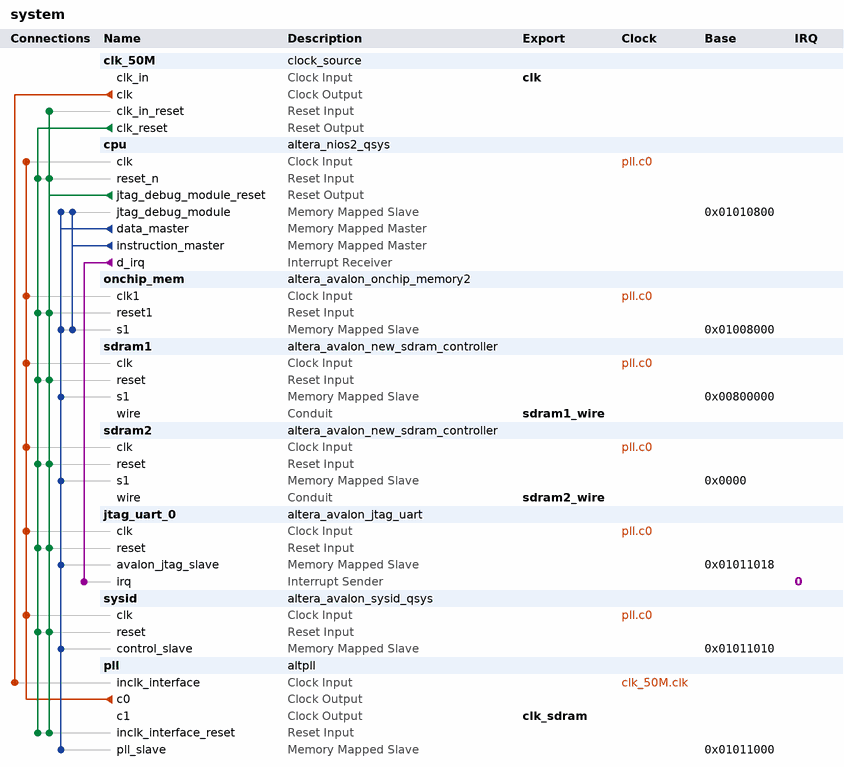
[diagram p0: system contents]
# Platform Designer (Qsys) system system, Cyclone II EP2C35F672C8
# Parameters at their usual value, and those the tool derives, are not listed.
package require -exact qsys 13.0.1.99.2
create_system system
set_project_property DEVICE_FAMILY {Cyclone II}
set_project_property DEVICE EP2C35F672C8

add_instance clk_50M clock_source 13.0
set_instance_parameter_value clk_50M clockFrequency 50000000

add_instance cpu altera_nios2_qsys 13.0
set_instance_parameter_value cpu resetSlave onchip_mem.s1
set_instance_parameter_value cpu mmu_TLBMissExcSlave None
set_instance_parameter_value cpu exceptionSlave onchip_mem.s1
set_instance_parameter_value cpu breakSlave cpu.jtag_debug_module
set_instance_parameter_value cpu impl Tiny
set_instance_parameter_value cpu icache_size 4096

add_instance onchip_mem altera_avalon_onchip_memory2 13.0.1.99.2
set_instance_parameter_value onchip_mem dataWidth 32
set_instance_parameter_value onchip_mem dualPort false
set_instance_parameter_value onchip_mem initMemContent true
set_instance_parameter_value onchip_mem initializationFileName onchip_mem.hex
set_instance_parameter_value onchip_mem memorySize 32768

add_instance sdram1 altera_avalon_new_sdram_controller 13.0.1.99.2
set_instance_parameter_value sdram1 TAC 5.5
set_instance_parameter_value sdram1 TRCD 20.0
set_instance_parameter_value sdram1 TRP 20.0
set_instance_parameter_value sdram1 casLatency 3
set_instance_parameter_value sdram1 columnWidth 8
set_instance_parameter_value sdram1 dataWidth 16
set_instance_parameter_value sdram1 generateSimulationModel false
set_instance_parameter_value sdram1 model single_Micron_MT48LC4M32B2_7_chip
set_instance_parameter_value sdram1 numberOfBanks 4
set_instance_parameter_value sdram1 numberOfChipSelects 1
set_instance_parameter_value sdram1 powerUpDelay 100.0
set_instance_parameter_value sdram1 refreshPeriod 15.625
set_instance_parameter_value sdram1 rowWidth 12

add_instance sdram2 altera_avalon_new_sdram_controller 13.0.1.99.2
set_instance_parameter_value sdram2 TAC 5.5
set_instance_parameter_value sdram2 TRCD 20.0
set_instance_parameter_value sdram2 TRP 20.0
set_instance_parameter_value sdram2 casLatency 3
set_instance_parameter_value sdram2 columnWidth 8
set_instance_parameter_value sdram2 dataWidth 16
set_instance_parameter_value sdram2 generateSimulationModel false
set_instance_parameter_value sdram2 model single_Micron_MT48LC4M32B2_7_chip
set_instance_parameter_value sdram2 numberOfBanks 4
set_instance_parameter_value sdram2 numberOfChipSelects 1
set_instance_parameter_value sdram2 powerUpDelay 100.0
set_instance_parameter_value sdram2 refreshPeriod 15.625
set_instance_parameter_value sdram2 rowWidth 12

add_instance jtag_uart_0 altera_avalon_jtag_uart 13.0.1.99.2
set_instance_parameter_value jtag_uart_0 simInteractiveOptions NO_INTERACTIVE_WINDOWS

add_instance sysid altera_avalon_sysid_qsys 13.0
set_instance_parameter_value sysid id 0

add_instance pll altpll 13.0
set_instance_parameter_value pll INCLK0_INPUT_FREQUENCY 20000
set_instance_parameter_value pll CLK0_MULTIPLY_BY 1
set_instance_parameter_value pll CLK1_MULTIPLY_BY 1
set_instance_parameter_value pll CLK0_DIVIDE_BY 1
set_instance_parameter_value pll CLK1_DIVIDE_BY 1
set_instance_parameter_value pll CLK1_PHASE_SHIFT -3000
set_instance_parameter_value pll CLK1_DUTY_CYCLE 50
set_instance_parameter_value pll PORT_clk1 PORT_USED
set_instance_parameter_value pll PORT_clk2 PORT_UNUSED
set_instance_parameter_value pll PORT_clk3 PORT_UNUSED
set_instance_parameter_value pll PORT_ARESET PORT_USED
set_instance_parameter_value pll PORT_LOCKED PORT_USED

# connections
add_connection clk_50M.clk pll.inclk_interface clock
add_connection pll.c0 cpu.clk clock
add_connection pll.c0 jtag_uart_0.clk clock
add_connection pll.c0 onchip_mem.clk1 clock
add_connection pll.c0 sdram1.clk clock
add_connection pll.c0 sdram2.clk clock
add_connection pll.c0 sysid.clk clock
add_connection clk_50M.clk_reset cpu.reset_n reset
add_connection clk_50M.clk_reset jtag_uart_0.reset reset
add_connection clk_50M.clk_reset onchip_mem.reset1 reset
add_connection clk_50M.clk_reset pll.inclk_interface_reset reset
add_connection clk_50M.clk_reset sdram1.reset reset
add_connection clk_50M.clk_reset sdram2.reset reset
add_connection clk_50M.clk_reset sysid.reset reset
add_connection cpu.jtag_debug_module_reset clk_50M.clk_in_reset reset
add_connection cpu.jtag_debug_module_reset cpu.reset_n reset
add_connection cpu.jtag_debug_module_reset jtag_uart_0.reset reset
add_connection cpu.jtag_debug_module_reset onchip_mem.reset1 reset
add_connection cpu.jtag_debug_module_reset pll.inclk_interface_reset reset
add_connection cpu.jtag_debug_module_reset sdram1.reset reset
add_connection cpu.jtag_debug_module_reset sdram2.reset reset
add_connection cpu.jtag_debug_module_reset sysid.reset reset
add_connection cpu.data_master cpu.jtag_debug_module avalon
set_connection_parameter_value cpu.data_master/cpu.jtag_debug_module baseAddress 0x01010800
add_connection cpu.data_master jtag_uart_0.avalon_jtag_slave avalon
set_connection_parameter_value cpu.data_master/jtag_uart_0.avalon_jtag_slave baseAddress 0x01011018
add_connection cpu.data_master onchip_mem.s1 avalon
set_connection_parameter_value cpu.data_master/onchip_mem.s1 baseAddress 0x01008000
add_connection cpu.data_master pll.pll_slave avalon
set_connection_parameter_value cpu.data_master/pll.pll_slave baseAddress 0x01011000
add_connection cpu.data_master sdram1.s1 avalon
set_connection_parameter_value cpu.data_master/sdram1.s1 baseAddress 0x00800000
add_connection cpu.data_master sdram2.s1 avalon
set_connection_parameter_value cpu.data_master/sdram2.s1 baseAddress 0x0000
add_connection cpu.data_master sysid.control_slave avalon
set_connection_parameter_value cpu.data_master/sysid.control_slave baseAddress 0x01011010
add_connection cpu.instruction_master cpu.jtag_debug_module avalon
set_connection_parameter_value cpu.instruction_master/cpu.jtag_debug_module baseAddress 0x01010800
add_connection cpu.instruction_master onchip_mem.s1 avalon
set_connection_parameter_value cpu.instruction_master/onchip_mem.s1 baseAddress 0x01008000
add_connection cpu.d_irq jtag_uart_0.irq interrupt
set_connection_parameter_value cpu.d_irq/jtag_uart_0.irq irqNumber 0

# exported interfaces
add_interface clk clock sink
set_interface_property clk EXPORT_OF clk_50M.clk_in
add_interface clk_sdram clock source
set_interface_property clk_sdram EXPORT_OF pll.c1
add_interface sdram1_wire conduit end
set_interface_property sdram1_wire EXPORT_OF sdram1.wire
add_interface sdram2_wire conduit end
set_interface_property sdram2_wire EXPORT_OF sdram2.wire

set_interconnect_requirement {$system} qsys_mm.clockCrossingAdapter HANDSHAKE
set_interconnect_requirement {$system} qsys_mm.maxAdditionalLatency 1

save_system system.qsys
